# Altium schematic sheet Power_.SchDoc
size A4
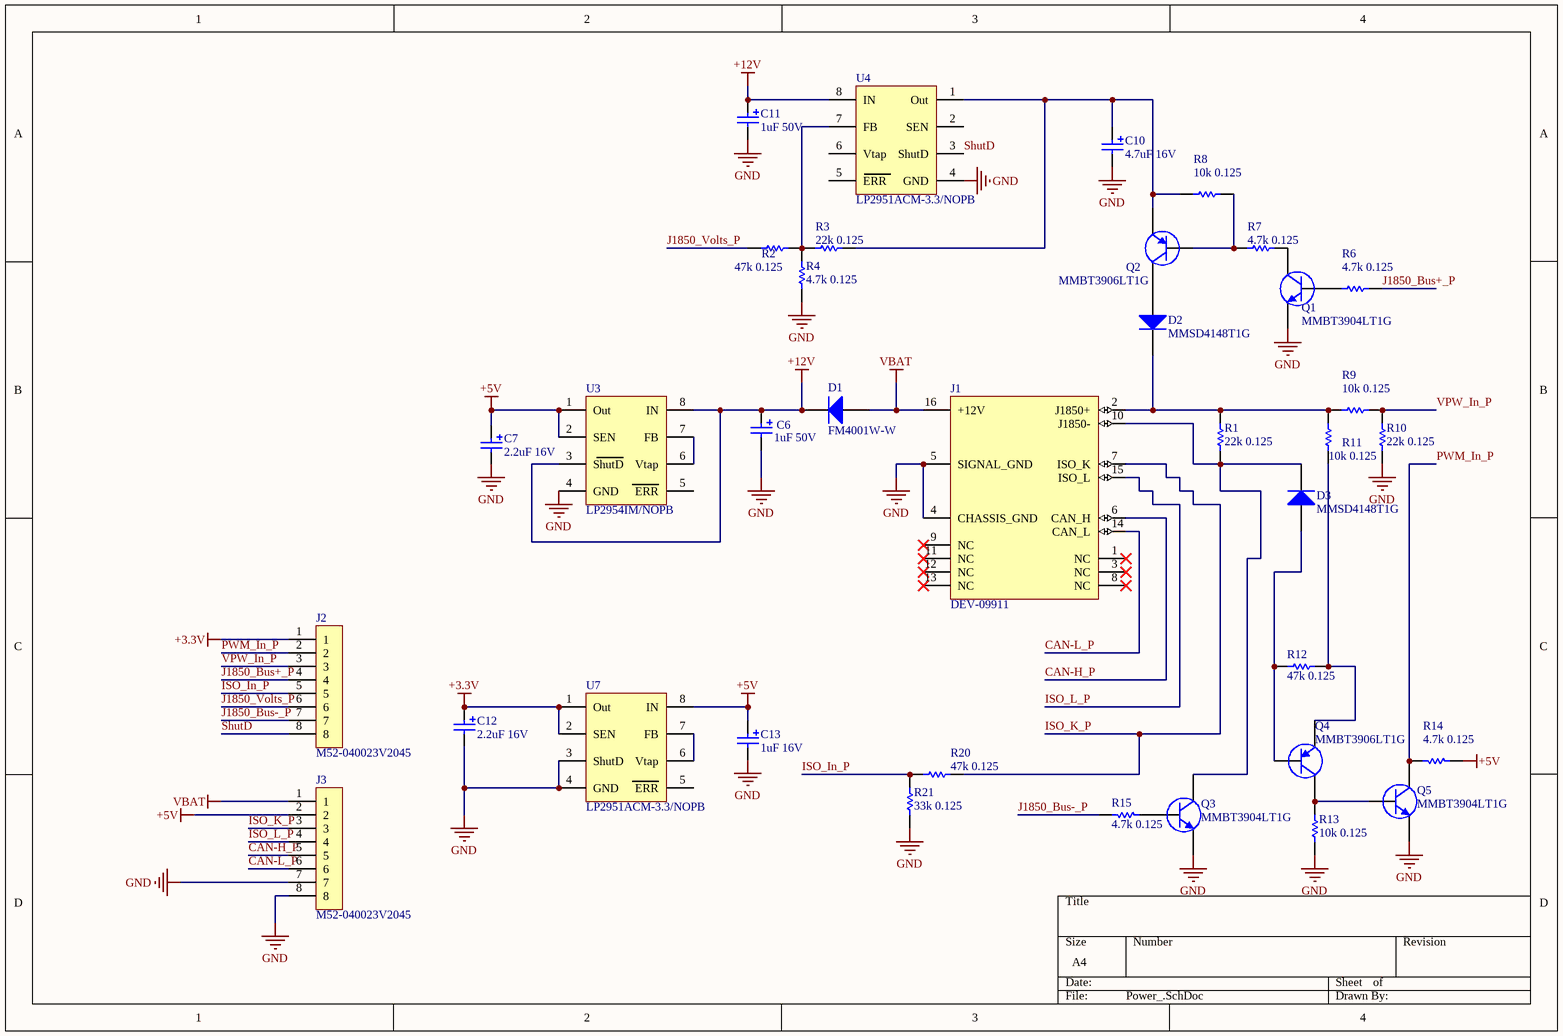
[diagram p0: Power_.SchDoc]

## Parts
C6  1uF 50V  [C1005]
C7  2.2uF 16V  [C0603]
C10  4.7uF 16V  [C1005]
C11  1uF 50V  [C1005]
C12  2.2uF 16V  [C0603]
C13  1uF 16V  [C0603]
D1  FM4001W-W  [SMA,2.8mm]
D2  MMSD4148T1G  [SOD123]
D3  MMSD4148T1G  [SOD123]
J1  DEV-09911  [DEV-09911 - II]
J2  M52-040023V2045  [M52-040023V2045]
J3  M52-040023V2045  [M52-040023V2045]
Q1  MMBT3904LT1G  [SOT23]
Q2  MMBT3906LT1G  [SOT23]
Q3  MMBT3904LT1G  [SOT23]
Q4  MMBT3906LT1G  [SOT23]
Q5  MMBT3904LT1G  [SOT23]
R1  22k 0.125  [ERA-0805]
R2  47k 0.125  [ERA-0805]
R3  22k 0.125  [ERA-0805]
R4  4.7k 0.125  [ERA-0805]
R6  4.7k 0.125  [ERA-0805]
R7  4.7k 0.125  [ERA-0805]
R8  10k 0.125  [ERA-0805]
R9  10k 0.125  [ERA-0805]
R10  22k 0.125  [ERA-0805]
R11  10k 0.125  [ERA-0805]
R12  47k 0.125  [ERA-0805]
R13  10k 0.125  [ERA-0805]
R14  4.7k 0.125  [ERA-0805]
R15  4.7k 0.125  [ERA-0805]
R20  47k 0.125  [ERA-0805]
R21  33k 0.125  [ERA-0805]
U3  LP2954IM/NOPB  [SOIC8N]
U4  LP2951ACM-3.3/NOPB  [SOIC8N]
U7  LP2951ACM-3.3/NOPB  [SOIC8N]

## Nets
+3.3V: C12.1 J2.1 U7.1(Out) U7.2(SEN)
+5V: C7.1 C13.1 J3.2 R14.1 U3.1(Out) U3.2(SEN) U7.8(IN)
+12V: C6.1 C11.1 D1.2(K) U3.3(ShutD) U3.8(IN) U4.8(IN)
GND: C6.2 C7.2 C10.2 C11.2 C12.2 C13.2 J1.4(CHASSIS_GND) J1.5(SIGNAL_GND) J3.7 J3.8 Q1.2(E) Q3.2(E) Q5.2(E) R4.1 R10.1 R13.2 R21.1 U3.4(GND) U4.4(GND) U7.3(ShutD) U7.4(GND)
VBAT: D1.1(A) J1.16(+12V) J3.1
CAN-H_P: J1.6(CAN_H) J3.5
CAN-L_P: J1.14(CAN_L) J3.6
ISO_In_P: J2.5 R20.1 R21.2
ISO_K_P: J1.7(ISO_K) J3.3 R20.2
ISO_L_P: J1.15(ISO_L) J3.4
J1850_Bus+_P: J2.4 R6.2
J1850_Bus-_P: J2.7 R15.2
J1850_Volts_P: J2.6 R2.1
PWM_In_P: J2.2 Q5.3(C) R14.2
ShutD: J2.8 U4.3(ShutD)
VPW_In_P: J2.3 R9.1 R10.2
NetC10_1: C10.1 Q2.2(E) R3.2 R8.2 U4.1(Out)
NetD2_1: D2.1(A) Q2.3(C)
NetD2_2: D2.2(C) J1.2(J1850+) R1.2 R9.2 R11.1
NetD3_1: D3.1(A) Q4.1(B) R12.1
NetD3_2: D3.2(C) J1.10(J1850-) Q3.3(C) R1.1
NetQ1_1: Q1.1(B) R6.1
NetQ1_3: Q1.3(C) R7.2
NetQ2_1: Q2.1(B) R7.1 R8.1
NetQ3_1: Q3.1(B) R15.1
NetQ4_2: Q4.2(E) R11.2 R12.2
NetQ4_3: Q4.3(C) Q5.1(B) R13.1
NetR2_2: R2.2 R3.1 R4.2 U4.7(FB)
NetU3_6: U3.6(Vtap) U3.7(FB)
NetU7_6: U7.6(Vtap) U7.7(FB)

Not connected (* = marked no-connect by the designer): J1 1(NC)* 3(NC)* 8(NC)* 9(NC)* 11(NC)* 12(NC)* 13(NC)*; U3 5(ERR); U4 2(SEN) 5(ERR) 6(Vtap); U7 5(ERR)

## Library data of the parts
C6 C11 = 298D105X0050P2T: Surface-Mount Electrolitic Tantalum Capacitor, 1uF, 20% Tolerance, 1005 Size, 50V; Type: Polarity; PackageReference: 1005; Publisher: Altium Limited; PackageDescription: Chip Capacitor; Site: http://www.vishay.com/doc?40065; Value: 1uF 50V
C7 C12 = 298D225X0016M2T: Surface-Mount Electrolitic Tantalum Capacitor, 2.2uF, 10% Tolerance, 0603 Size, 16V; Type: Polarity; PackageReference: 0603; Publisher: Altium Limited; PackageDescription: Chip Capacitor; Site: http://www.vishay.com/doc?40065; Value: 2.2uF 16V
C10 = 298D475X0016P2T: Surface-Mount Electrolitic Tantalum Capacitor, 4.7uF, 20% Tolerance, 1005 Size, 16V; Type: Polarity; PackageReference: 1005; Publisher: Altium Limited; PackageDescription: Chip Capacitor; Site: http://www.vishay.com/doc?40065; Value: 4.7uF 16V
C13 = 298D105X9016M2T: Surface-Mount Electrolitic Tantalum Capacitor, 1uF, 10% Tolerance, 0603 Size, 16V; Type: Polarity; PackageReference: 0603; Publisher: Altium Limited; PackageDescription: Chip Capacitor; Site: http://www.vishay.com/doc?40065; Value: 1uF 16V
D1 = FM4001W-W: 1 Amp 50V  Rectifier; PackageReference: DO214AC(SMA); ComponentLink1Description: Datasheet; ComponentLink1URL: http://lib.chipdip.ru/758/DOC000758182.pdf; Type: FM4001W-W
D2 D3 = MMSD4148T1G: High Conductance Fast Diode; Manufacturer: OnSemi; Approved: M. Jablonski; TargetLibrary: Diodes; Current: 200 mA; Published: 6/4/2009; Publisher: Vanteon; LeadFree: Yes; RoHS: Yes; PartNumber: MMSD4148T1G; ComponentLink1Description: Datasheet; ComponentLink1URL: http://www.onsemi.com/pub_link/Collateral/MMSD4148T1-D.PDF; Status: Active; Supplier 1: Digi-Key; Supplier Part Number 1: MMSD4148T1GOSCT-ND; Type: MMSD4148T1G
J1 = OBDII_DEV-09911: OBD-II Connector; Manufacturer: SparkFun Electronics; PartNumber: DEV-09911; Type: DEV-09911
J2 J3 = M52-040023V2045: CONN HEADER .050" 20POS PCB GOLD; Manufacturer: Harwin; PartNumber: M52-040023V2045; Type: M52-040023V2045
Q1 Q3 Q5 = MMBT3904LT1G: NPN 3904 General Purpose Amplifier; Manufacturer: ON Semiconductor; Value: 0.2A, 40V; Approved: Yes by Implemenation; TargetLibrary: Transistors; Published: 8/13/2009; Publisher: Vanteon; LeadFree: Yes; RoHS: Yes; PartNumber: MMBT3904LT1G; ComponentLink1Description: Datasheet; ComponentLink1URL: http://www.onsemi.com/pub_link/Collateral/MMBT3904LT1-D.PDF; Status: Active; Supplier 1: Digi-Key; Supplier Part Number 1: MMBT3904LT1GOSCT-ND
Q2 Q4 = MMBT3906LT1G: PNP 3906 General Purpose Amplifier; Manufacturer: ON Semiconductor; Value: 0.2A, -40V; Approved: Yes by Implemenation; TargetLibrary: Transistors; Published: 8/13/2009; Publisher: Vanteon; LeadFree: Yes; RoHS: Yes; PartNumber: MMBT3906LT1G; ComponentLink1Description: Datasheet; ComponentLink1URL: http://www.onsemi.com/pub_link/Collateral/MMBT3906LT1-D.PDF; Status: Active; Supplier 1: Digi-Key; Supplier Part Number 1: MMBT3906LT1GOSCT-ND
R1 R3 R10 = ERA-6AEB223V: Rectangular Thick Film Chip Resistor, 22 kOhm, 0.1% Tolerance, 0805 Size, 0.125 W; Note: If flow soldering, adjust pad width of PCB Footprint to 0.7 - 0.8 times the width of the resistor.; LatestRevisionNote: Silkscreen size reduced.; PackageReference: ERA-0805; Code_IPC: 2012 [0805]; ComponentLink1Description: Manufacturer Link; ComponentLink1URL: http://industrial.panasonic.com/www-data/pdf/AOA0000/AOA0000CE26.pdf; Value: 22k 0.125
R2 R12 R20 = ERA-6AEB473V: Rectangular Thick Film Chip Resistor, 47 kOhm, 0.1% Tolerance, 0805 Size, 0.125 W; Note: If flow soldering, adjust pad width of PCB Footprint to 0.7 - 0.8 times the width of the resistor.; LatestRevisionNote: Silkscreen size reduced.; PackageReference: ERA-0805; Code_IPC: 2012 [0805]; ComponentLink1Description: Manufacturer Link; ComponentLink1URL: http://industrial.panasonic.com/www-data/pdf/AOA0000/AOA0000CE26.pdf; Value: 47k 0.125
R4 R6 R7 R14 R15 = ERA-6AEB472V: Rectangular Thick Film Chip Resistor, 4.7 kOhm, 0.1% Tolerance, 0805 Size, 0.125 W; Note: If flow soldering, adjust pad width of PCB Footprint to 0.7 - 0.8 times the width of the resistor.; LatestRevisionNote: Silkscreen size reduced.; PackageReference: ERA-0805; Code_IPC: 2012 [0805]; ComponentLink1Description: Manufacturer Link; ComponentLink1URL: http://industrial.panasonic.com/www-data/pdf/AOA0000/AOA0000CE26.pdf; Value: 4.7k 0.125
R8 R9 R11 R13 = ERA-6AEB103V: Rectangular Thick Film Chip Resistor, 10 kOhm, 0.1% Tolerance, 0805 Size, 0.125 W; Note: If flow soldering, adjust pad width of PCB Footprint to 0.7 - 0.8 times the width of the resistor.; LatestRevisionNote: Silkscreen size reduced.; PackageReference: ERA-0805; Code_IPC: 2012 [0805]; ComponentLink1Description: Manufacturer Link; ComponentLink1URL: http://industrial.panasonic.com/www-data/pdf/AOA0000/AOA0000CE26.pdf; Value: 10k 0.125
R21 = ERA-6AEB333V: Rectangular Thick Film Chip Resistor, 33 kOhm, 0.1% Tolerance, 0805 Size, 0.125 W; Note: If flow soldering, adjust pad width of PCB Footprint to 0.7 - 0.8 times the width of the resistor.; LatestRevisionNote: Silkscreen size reduced.; PackageReference: ERA-0805; Code_IPC: 2012 [0805]; ComponentLink1Description: Manufacturer Link; ComponentLink1URL: http://industrial.panasonic.com/www-data/pdf/AOA0000/AOA0000CE26.pdf; Value: 33k 0.125
U3 = LP2954IM/NOPB: LDO Voltage Regulators  1.2V-29V 0.25A SOIC8; Manufacturer: Texas Instruments; Approved: Yes by Implementation; TargetLibrary: Power IC; PartNumber: LP2954IM/NOPB; ComponentLink1Description: Datasheet; ComponentLink1URL: http://www.ti.com/general/docs/lit/getliterature.tsp?literatureNumber=snvs764n; LeadFree: Yes; RoHS: Yes; Status: Active; Supplier 1: Digi-Key; Supplier Part Number 1: LP2954IM/NOPB; Type: LP2954IM/NOPB
U4 U7 = LP2951ACM-3.3/NOPB: LDO Voltage Regulators  1.2V-37V 0.1A SOIC8; Manufacturer: Texas Instruments; Approved: Yes by Implementation; TargetLibrary: Power IC; PartNumber: LP2951ACM-3.3/NOPB; ComponentLink1Description: Datasheet; ComponentLink1URL: http://www.ti.com/general/docs/lit/getliterature.tsp?literatureNumber=snvs764n; LeadFree: Yes; RoHS: Yes; Status: Active; Supplier 1: Digi-Key; Supplier Part Number 1: LP2951ACM-3.3/NOPB; Type: LP2951ACM-3.3/NOPB